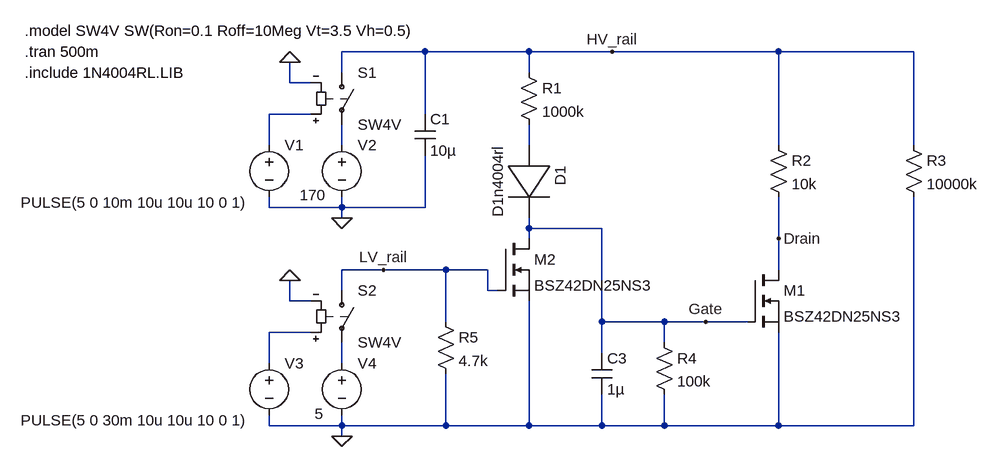
[diagram p0: schematic HV_bleed.asc]
HV_bleed.asc, the LTspice schematic file:
Version 4
SHEET 1 1360 680
WIRE 496 16 368 16
WIRE 656 16 496 16
WIRE 784 16 656 16
WIRE 1040 16 784 16
WIRE 1248 16 1040 16
WIRE 368 48 368 16
WIRE 656 48 656 16
WIRE 288 64 288 32
WIRE 320 64 288 64
WIRE 320 112 256 112
WIRE 496 112 496 16
WIRE 256 160 256 112
WIRE 368 160 368 128
WIRE 656 160 656 128
WIRE 1040 160 1040 16
WIRE 1248 160 1248 16
WIRE 256 256 256 240
WIRE 368 256 368 240
WIRE 368 256 256 256
WIRE 496 256 496 176
WIRE 496 256 368 256
WIRE 368 272 368 256
WIRE 656 288 656 272
WIRE 768 288 656 288
WIRE 656 304 656 288
WIRE 1040 304 1040 240
WIRE 432 352 368 352
WIRE 528 352 432 352
WIRE 592 352 528 352
WIRE 1040 352 1040 304
WIRE 368 384 368 352
WIRE 592 384 592 352
WIRE 608 384 592 384
WIRE 288 400 288 368
WIRE 320 400 288 400
WIRE 528 432 528 352
WIRE 768 432 768 288
WIRE 864 432 768 432
WIRE 928 432 864 432
WIRE 992 432 928 432
WIRE 320 448 256 448
WIRE 864 464 864 432
WIRE 768 480 768 432
WIRE 256 496 256 448
WIRE 368 496 368 464
WIRE 256 592 256 576
WIRE 368 592 368 576
WIRE 368 592 256 592
WIRE 528 592 528 512
WIRE 528 592 368 592
WIRE 656 592 656 400
WIRE 656 592 528 592
WIRE 768 592 768 544
WIRE 768 592 656 592
WIRE 864 592 864 544
WIRE 864 592 768 592
WIRE 1040 592 1040 448
WIRE 1040 592 864 592
WIRE 1248 592 1248 240
WIRE 1248 592 1040 592
WIRE 368 608 368 592
FLAG 368 608 0
FLAG 288 368 0
FLAG 368 272 0
FLAG 288 32 0
FLAG 784 16 HV_rail
FLAG 432 352 LV_rail
FLAG 928 432 Gate
FLAG 1040 304 Drain
SYMBOL cap 480 112 R0
SYMATTR InstName C1
SYMATTR Value 10µ
SYMBOL sw 368 368 R0
SYMATTR InstName S2
SYMATTR Value SW4V
SYMBOL voltage 368 480 R0
WINDOW 3 -42 94 Left 2
WINDOW 123 0 0 Left 0
WINDOW 39 0 0 Left 0
SYMATTR Value 5
SYMATTR InstName V4
SYMBOL nmos 992 352 R0
SYMATTR InstName M1
SYMATTR Value BSZ42DN25NS3
SYMBOL res 640 32 R0
SYMATTR InstName R1
SYMATTR Value 1000k
SYMBOL 1N4004RL 656 192 R90
SYMATTR InstName D1
SYMBOL res 848 448 R0
SYMATTR InstName R4
SYMATTR Value 100k
SYMBOL cap 752 480 R0
SYMATTR InstName C3
SYMATTR Value 1µ
SYMBOL voltage 256 480 R0
WINDOW 3 -382 104 Left 2
WINDOW 123 0 0 Left 0
WINDOW 39 0 0 Left 0
SYMATTR Value PULSE(5 0 30m 10u 10u 10 0 1)
SYMATTR InstName V3
SYMBOL sw 368 32 R0
SYMATTR InstName S1
SYMATTR Value SW4V
SYMBOL voltage 368 144 R0
WINDOW 3 -65 93 Left 2
WINDOW 123 0 0 Left 0
WINDOW 39 0 0 Left 0
SYMATTR Value 170
SYMATTR InstName V2
SYMBOL voltage 256 144 R0
WINDOW 3 -382 104 Left 2
WINDOW 123 0 0 Left 0
WINDOW 39 0 0 Left 0
SYMATTR Value PULSE(5 0 10m 10u 10u 10 0 1)
SYMATTR InstName V1
SYMBOL res 1024 144 R0
SYMATTR InstName R2
SYMATTR Value 10k
SYMBOL res 1232 144 R0
SYMATTR InstName R3
SYMATTR Value 10000k
SYMBOL nmos 608 304 R0
SYMATTR InstName M2
SYMATTR Value BSZ42DN25NS3
SYMBOL res 512 416 R0
SYMATTR InstName R5
SYMATTR Value 4.7k
TEXT -120 16 Left 2 !.tran 500m
TEXT -120 -16 Left 2 !.model SW4V SW(Ron=0.1 Roff=10Meg Vt=3.5 Vh=0.5)
TEXT -120 48 Left 2 !.include 1N4004RL.LIB

The netlist it stands for:
* HV_bleed.asc
C1 HV_rail 0 10µ
S2 LV_rail N005 N004 0 SW4V
V4 N005 0 5
M1 Drain Gate 0 0 BSZ42DN25NS3
R1 HV_rail N003 1000k
D1 N003 Gate D1n4004rl
R4 Gate 0 100k
C3 Gate 0 1µ
V3 N004 0 PULSE(5 0 30m 10u 10u 10 0 1)
S1 HV_rail N002 N001 0 SW4V
V2 N002 0 170
V1 N001 0 PULSE(5 0 10m 10u 10u 10 0 1)
R2 HV_rail Drain 10k
R3 HV_rail 0 10000k
M2 Gate LV_rail 0 0 BSZ42DN25NS3
R5 LV_rail 0 4.7k
.model D D
.lib standard.dio
.model NMOS NMOS
.model PMOS PMOS
.lib standard.mos
.tran 500m
.model SW4V SW(Ron=0.1 Roff=10Meg Vt=3.5 Vh=0.5)
.include 1N4004RL.LIB
.lib 1N4004RL.LIB
.backanno
.end